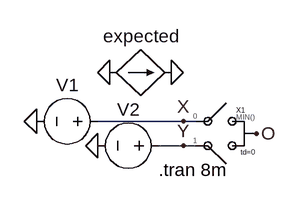
[diagram p0: schematic test-amux-min.asc]
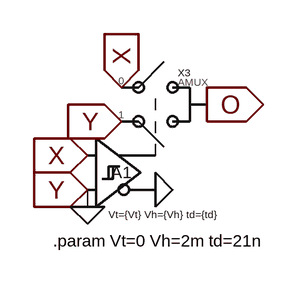
[diagram p1: sub-circuit amux-min.asc]
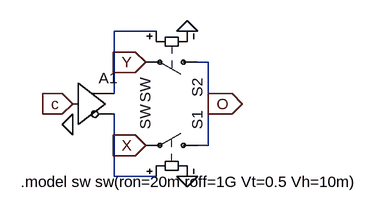
[diagram p2: sub-circuit amux-2to1.asc]
test-amux-min.asc, the LTspice schematic file:
Version 4
SHEET 1 880 680
WIRE 48 144 -64 144
WIRE 64 144 48 144
WIRE 48 176 16 176
WIRE 64 176 48 176
FLAG -64 176 0
FLAG -144 144 0
FLAG 144 160 O
FLAG 48 144 X
FLAG 48 176 Y
FLAG -48 80 0
FLAG 32 80 0
SYMBOL voltage -48 144 R90
WINDOW 0 -32 56 VBottom 2
WINDOW 3 32 56 Invisible 2
WINDOW 123 0 0 Left 0
WINDOW 39 0 0 Left 0
SYMATTR InstName V1
SYMATTR Value SINE(0 1 1k)
SYMBOL voltage 32 176 R90
WINDOW 0 -32 56 VBottom 2
WINDOW 3 32 56 Invisible 2
WINDOW 123 0 0 Left 0
WINDOW 39 0 0 Left 0
SYMATTR InstName V2
SYMATTR Value SINE(0 0.5 10k)
SYMBOL bi -48 80 R270
WINDOW 0 32 40 VTop 2
WINDOW 3 -32 40 Invisible 2
SYMATTR InstName expected
SYMATTR Value I=MIN(V(x),V(y))
SYMATTR Value2 Rpar=1
SYMBOL amux-min 96 176 R0
WINDOW 39 27 9 Left 0
SYMATTR InstName X1
SYMATTR SpiceLine td=0
TEXT 16 208 Left 2 !.tran 8m

amux-min.asc, the sub-circuit schematic file:
Version 4
SHEET 1 880 680
FLAG 16 -64 X
IOPIN 16 -64 In
FLAG 16 -32 Y
IOPIN 16 -32 In
FLAG 96 -48 O
IOPIN 96 -48 Out
FLAG -16 32 Y
IOPIN -16 32 In
FLAG -16 0 X
IOPIN -16 0 In
FLAG -16 48 0
FLAG 48 32 0
SYMBOL amux-2to1 48 -32 R0
SYMATTR InstName X3
SYMBOL Digital\\diffschmitt -16 -48 R0
WINDOW 0 32 64 Center 1
WINDOW 3 20 103 Left 0
SYMATTR InstName A1
SYMATTR Value Vt={Vt} Vh={Vh} td={td}
TEXT -48 80 Left 1 !.param Vt=0 Vh=2m td=21n

amux-2to1.asc, the sub-circuit schematic file:
Version 4
SHEET 1 880 680
WIRE 64 -160 0 -160
WIRE 144 -112 128 -112
WIRE 0 -64 0 -160
WIRE 144 -48 144 -112
WIRE 144 16 144 -48
WIRE 144 16 128 16
WIRE 0 64 0 -32
WIRE 64 64 0 64
FLAG 112 64 0
FLAG -64 -48 c
IOPIN -64 -48 In
FLAG 112 -160 0
FLAG 48 16 X
IOPIN 48 16 In
FLAG 48 -112 Y
IOPIN 48 -112 In
FLAG 144 -48 O
IOPIN 144 -48 Out
FLAG -64 -16 0
SYMBOL sw 144 16 M270
SYMATTR InstName S1
SYMBOL sw 144 -112 R90
SYMATTR InstName S2
SYMBOL Digital\\buf -64 -112 R0
SYMATTR InstName A1
TEXT -144 72 Left 0 !.model sw sw(ron=20m roff=1G Vt=0.5 Vh=10m)

The netlist it stands for:
* test-amux-min.asc
V1 X 0 SINE(0 1 1k)
V2 Y 0 SINE(0 0.5 10k)
B§expected 0 0 I=MIN(V(x),V(y)) Rpar=1
XX1 O X Y amux-min params: td=0

* block symbol definitions
.subckt amux-min O X Y
XX3 P001 O X Y amux-2to1
A1 X Y 0 0 0 0 P001 0 SCHMITT Vt={Vt} Vh={Vh} td={td}
.param Vt=0 Vh=2m td=21n
.ends amux-min

.subckt amux-2to1 c O X Y
S1 O X N002 0 SW
S2 O Y N001 0 SW
A1 c 0 0 0 0 N002 N001 0 BUF
.model sw sw(ron=20m roff=1G Vt=0.5 Vh=10m)
.ends amux-2to1

.tran 8m
.backanno
.end